# Altium schematic sheet TMC4671-EVAL_V1_2.SchDoc: TMC4671_EVAL_V1.0
size A4; DocumentNumber: 0; SheetNumber: 0; SheetTotal: 8
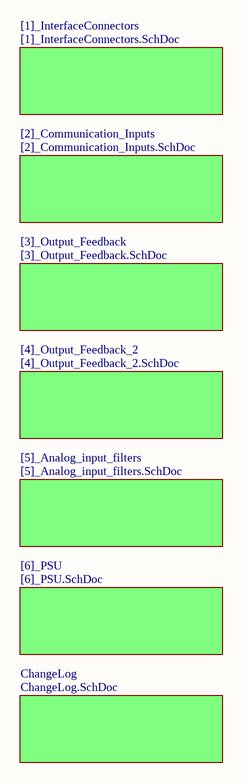
[diagram p0: TMC4671-EVAL_V1_2.SchDoc]

## Sub-sheets
[1]_InterfaceConnectors = [1]_InterfaceConnectors.SchDoc: no entries
[2]_Communication_Inputs = [2]_Communication_Inputs.SchDoc: no entries
[3]_Output_Feedback = [3]_Output_Feedback.SchDoc: no entries
[4]_Output_Feedback_2 = [4]_Output_Feedback_2.SchDoc: no entries
[5]_Analog_input_filters = [5]_Analog_input_filters.SchDoc: no entries
[6]_PSU = [6]_PSU.SchDoc: no entries
ChangeLog = ChangeLog.SchDoc: no entries

## Notes on the sheet
- Title:
- Size:
- Date:
- A4
- Project:
- Time:
- Sheet
- Version:
- of
- File: